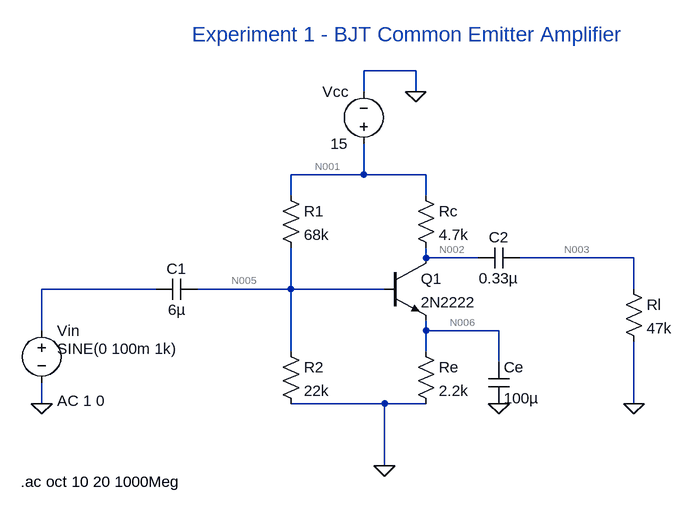
[diagram p0: schematic Experiment 1 - BJT Common Emitter Amplifier.asc]
Experiment 1 - BJT Common Emitter Amplifier.asc, the LTspice schematic file:
Version 4
SHEET 1 880 680
WIRE 192 -144 112 -144
WIRE 112 -112 112 -144
WIRE 192 -112 192 -144
WIRE 112 16 112 -32
WIRE 112 16 0 16
WIRE 208 16 112 16
WIRE 0 48 0 16
WIRE 208 48 208 16
WIRE 208 144 208 128
WIRE 288 144 208 144
WIRE 528 144 352 144
WIRE -208 192 -384 192
WIRE 0 192 0 128
WIRE 0 192 -144 192
WIRE 144 192 0 192
WIRE 528 192 528 144
WIRE -384 256 -384 192
WIRE 208 256 208 240
WIRE 320 256 208 256
WIRE 0 288 0 192
WIRE 208 288 208 256
WIRE 320 304 320 256
WIRE -384 368 -384 336
WIRE 144 368 0 368
WIRE 208 368 144 368
WIRE 528 368 528 272
WIRE 144 464 144 368
FLAG 144 464 0
FLAG 192 -112 0
FLAG -384 368 0
FLAG 528 368 0
FLAG 320 368 0
SYMBOL npn 144 144 R0
SYMATTR InstName Q1
SYMATTR Value 2N2222
SYMBOL cap 304 304 R0
SYMATTR InstName Ce
SYMATTR Value 100µ
SYMBOL cap 352 128 R90
WINDOW 0 0 32 VBottom 2
WINDOW 3 32 32 VTop 2
SYMATTR InstName C2
SYMATTR Value 0.33µ
SYMBOL cap -144 176 R90
WINDOW 0 0 32 VBottom 2
WINDOW 3 32 32 VTop 2
SYMATTR InstName C1
SYMATTR Value 6µ
SYMBOL res -16 272 R0
SYMATTR InstName R2
SYMATTR Value 22k
SYMBOL res -16 32 R0
SYMATTR InstName R1
SYMATTR Value 68k
SYMBOL res 192 32 R0
SYMATTR InstName Rc
SYMATTR Value 4.7k
SYMBOL res 512 176 R0
SYMATTR InstName Rl
SYMATTR Value 47k
SYMBOL res 192 272 R0
SYMATTR InstName Re
SYMATTR Value 2.2k
SYMBOL voltage 112 -16 R180
WINDOW 0 24 96 Left 2
WINDOW 3 24 16 Left 2
WINDOW 123 0 0 Left 0
WINDOW 39 0 0 Left 0
SYMATTR InstName Vcc
SYMATTR Value 15
SYMBOL voltage -384 240 R0
WINDOW 123 24 124 Left 2
WINDOW 39 0 0 Left 0
WINDOW 3 24 44 Left 2
SYMATTR Value2 AC 1 0
SYMATTR InstName Vin
SYMATTR Value SINE(0 100m 1k)
TEXT -416 488 Left 2 !.ac oct 10 20 1000Meg
TEXT -152 -200 Left 3 ;Experiment 1 - BJT Common Emitter Amplifier

The netlist it stands for:
* Experiment 1 - BJT Common Emitter Amplifier.asc
Q1 N002 N005 N006 0 2N2222
Ce N006 0 100µ
C2 N003 N002 0.33µ
C1 N005 N004 6µ
R2 N005 0 22k
R1 N001 N005 68k
Rc N001 N002 4.7k
Rl N003 0 47k
Re N006 0 2.2k
Vcc N001 0 15
Vin N004 0 SINE(0 100m 1k) AC 1 0
.model NPN NPN
.model PNP PNP
.lib standard.bjt
.ac oct 10 20 1000Meg
* Experiment 1 - BJT Common Emitter Amplifier
.backanno
.end

* Results of the author's LTspice run, read from the files saved beside the schematic
* Operating Point, zero values left out:
*   V(n002) = 8.831 V
*   V(n005) = 3.563 V
*   V(n006) = 2.901 V
*   V(n001) = 15 V
*   Ic(Q1) = 1.313 mA
*   Ib(Q1) = 6.26 µA
*   Ie(Q1) = -1.319 mA
*   I(Re) = 1.319 mA
*   I(Rc) = 1.313 mA
*   I(R1) = 168.2 µA
*   I(R2) = 161.9 µA
*   I(Vcc) = -1.481 mA
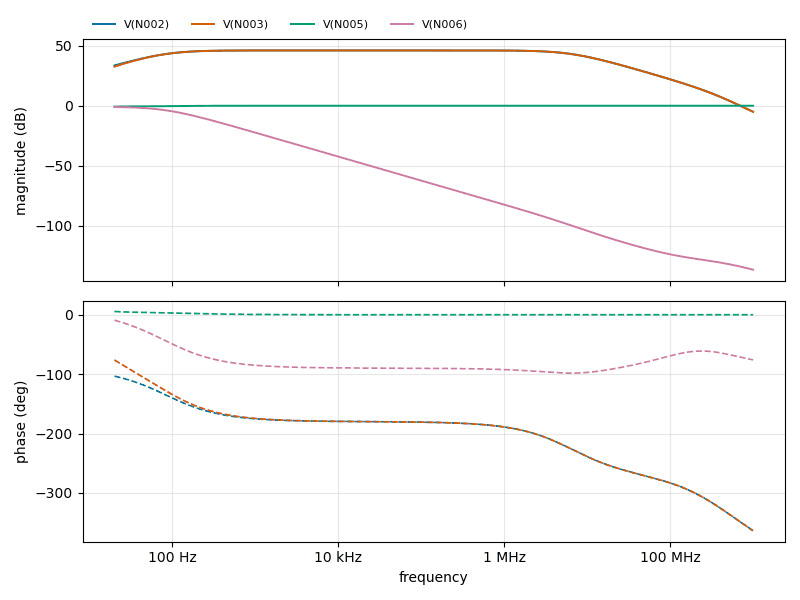
[diagram p1: AC Analysis of Experiment 1 - BJT Common Emitter Amplifier.asc, plotted from the saved traces]
* AC Analysis, 1 run:
*   V(N002): 33.66 dB at 20 Hz, -5.02 dB at 1 GHz, peak 46.13 dB at 23.53 kHz, 3 dB below the peak at 82.89 Hz and 6.438 MHz
*   V(N003): 32.65 dB at 20 Hz, -5.02 dB at 1 GHz, peak 46.13 dB at 23.53 kHz, 3 dB below the peak at 84.13 Hz and 6.438 MHz
*   V(N005): -0.68 dB at 20 Hz, -0.00 dB at 1 GHz, peak -0.00 dB at 1 GHz
*   V(N006): -1.06 dB at 20 Hz, -136.71 dB at 1 GHz, peak -1.06 dB at 20 Hz, 3 dB below the peak at 88.13 Hz